# EAGLE design AC-DC5V (EAGLE 9.6.2)
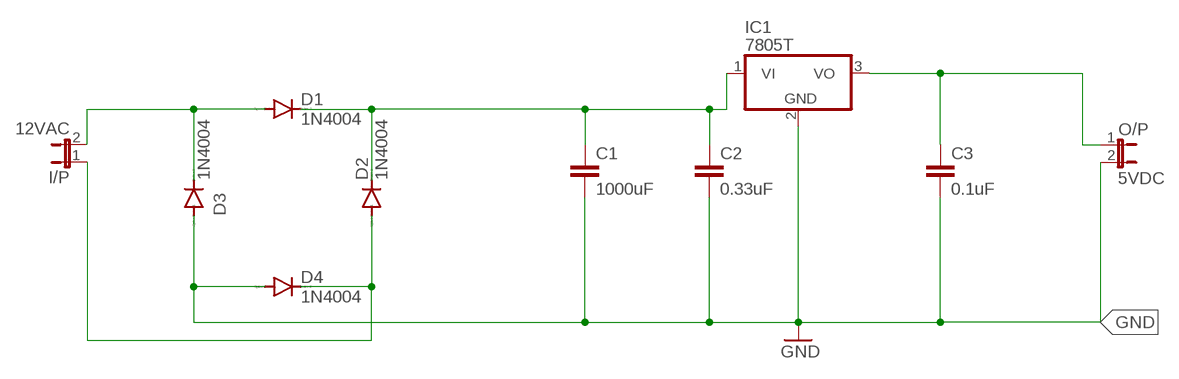
[diagram p0: schematic, sheet 1]

## Parts
C1  1000uF  C2,5-3  [C2.5-3]
C2  0.33uF  C2,5-3  [C2.5-3]
C3  0.1uF  C2,5-3  [C2.5-3]
D1  1N4004  [DO41-10]
D2  1N4004  [DO41-10]
D3  1N4004  [DO41-10]
D4  1N4004  [DO41-10]
I/P  12VAC  JP1E  [JP1]
IC1  7805T  [TO220H]
O/P  5VDC  JP1E  [JP1]

## Nets
GND: C1.2 C2.2 C3.2 D3.A D4.A IC1.2(GND) O/P.2
N$1: C3.1 IC1.3(VO) O/P.1
N$4: C1.1 C2.1 D1.C D2.C IC1.1(VI)
N$5: D2.A D4.C I/P.1
N$6: D1.A D3.C I/P.2

## Library data of the parts
C1-C3 = capacitor-wima:C: CAPACITOR naming: grid - package width
D1-D4 = diode:1N4004: DIODE general purpose rectifier, 1 A
I/P O/P = jumper:JP1E: JUMPER
IC1 = linear:78*: Positive VOLTAGE REGULATOR Source: http://cache.national.com/ds/LM/LM78L05.pdf http://www.fairchildsemi.com/ds/LM/LM7805.pdf

## Board
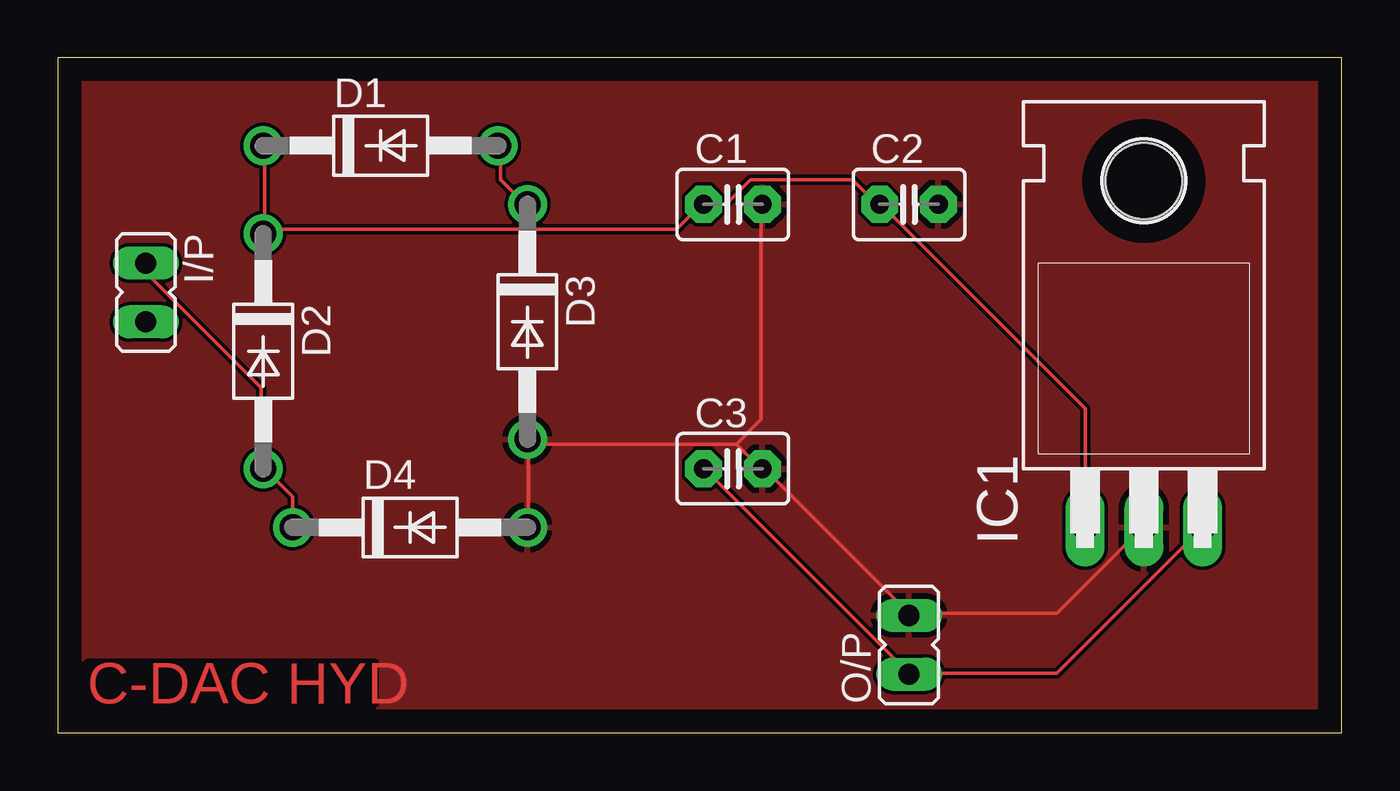
[diagram p1: board, top side]
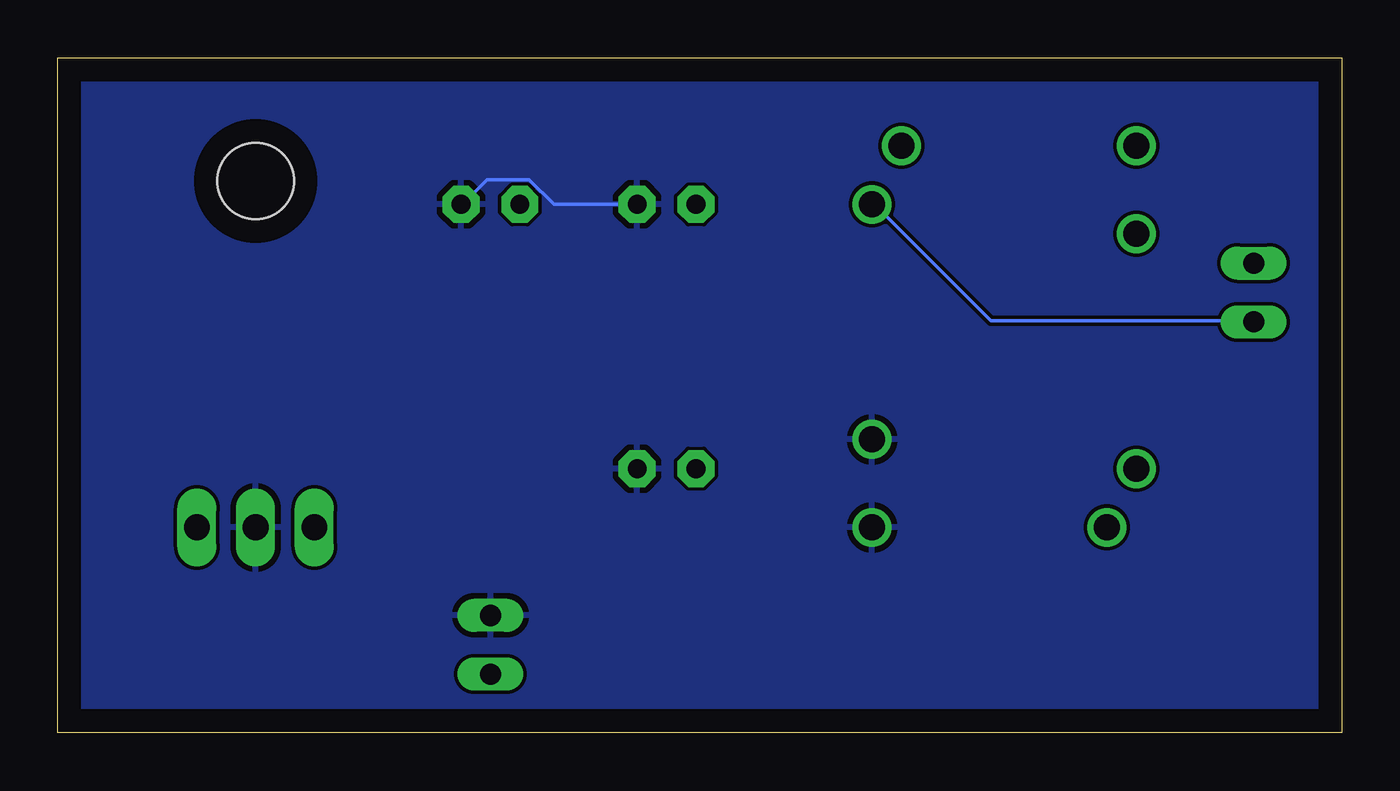
[diagram p2: board, bottom side, seen from below]

Size 55.55 x 29.2 mm. Coordinates in mm from the lower left corner, seen from the top.
Outline: 0,0 55.55,0 55.55,29.2 0,29.2 0,0
Copper layers (1*16): Top 0.035mm / dielectric 1.5mm / Bottom 0.035mm
Design rules "default": minimum track width 6mil, minimum drill 0.35mm, track to track 6mil, track to pad 6mil, pad to pad 6mil, via to via 6mil, smd to smd 6mil, copper to edge 40mil, drill to drill 6mil, minimum pad ring 10mil, minimum via ring 8mil, stop-mask expansion 4mil, vias tented up to drill 0mil, thermal gap 10mil

### Footprints (pad centres in the part's own frame; a part is rotated, then mirrored left to right if it is on the bottom)
C2.5-3 = drill 0.813 pad 1.6 octagon: 1 -1.27,0; 2 1.27,0
DO41-10 = drill 1.118: A 5.08,0; C -5.08,0
JP1 = drill 0.914 long: 1 0,-1.27; 2 0,1.27
TO220H = drill 1.118 long: 1 -2.54,-10.16; 2 0,-10.16; 3 2.54,-10.16 | hole 3.302: 0,4.826

### Placement (x,y rotation side)
C1  29.21,22.86 0 top
C2  36.83,22.86 0 top
C3  29.21,11.43 0 top
D1  13.97,25.4 0 top
D2  8.89,16.51 270 top
D3  20.32,17.78 270 top
D4  15.24,8.89 0 top
I/P  3.81,19.05 180 top
IC1  46.99,19.05 0 top
O/P  36.83,3.81 0 top

### Tracks (layer width: path | path; a pad name or v marks a point on that pad's centre or on a via)
GND
  Top 0.152: 20.37,12.5 20.37,12.65 D3.A 20.37,12.5 | 20.37,12.5 20.37,8.99 D4.A | 36.83,5.18 30.58,11.43 C3.2 30.43,11.43 29.36,12.5 | 36.83,5.18 43.23,5.18 46.89,8.84 IC1.2 | 36.83,5.18 O/P.2 | 29.36,12.5 20.37,12.5 | 29.36,12.5 30.43,13.56 30.43,22.86 C1.2
  Bottom 0.152: C1.2 34.09,22.86 35.15,23.93 36.98,23.93 38.05,22.86 C2.2
  pour Top: -2.54,31.75 57.15,31.75 57.15,-1.27 -1.27,-1.27 -2.54,-1.27
  pour Bottom: 58.42,33.02 58.42,-2.54 -3.81,-2.54 -3.81,33.02 -1.27,33.02 0,33.02
N$1
  Top 0.152: 36.83,2.59 27.99,11.43 C3.1 | IC1.3 43.23,2.59 36.83,2.59 | 36.83,2.59 O/P.1
N$4
  Top 0.152: 8.94,21.79 8.94,25.3 D1.C | 8.94,21.79 8.94,21.64 D2.C 8.94,21.79 | IC1.1 44.45,14.02 35.61,22.86 C2.1 35.46,22.86 34.39,23.93 29.97,23.93 28.91,22.86 C1.1 27.84,22.86 26.77,21.79 8.94,21.79
N$5
  Top 0.152: I/P.1 3.91,20.27 3.91,19.81 8.79,14.94 8.79,11.43 D2.A 8.94,11.43 10.16,10.21 D4.C
N$6
  Top 0.152: D1.A 19.15,25.3 19.15,23.93 20.22,22.86 D3.C
  Bottom 0.152: I/P.2 3.91,17.83 15.19,17.83 20.22,22.86 D3.C

### Text on the board
Top: C-DAC HYD